# EAGLE design WallSwitch (EAGLE 6.5.0)
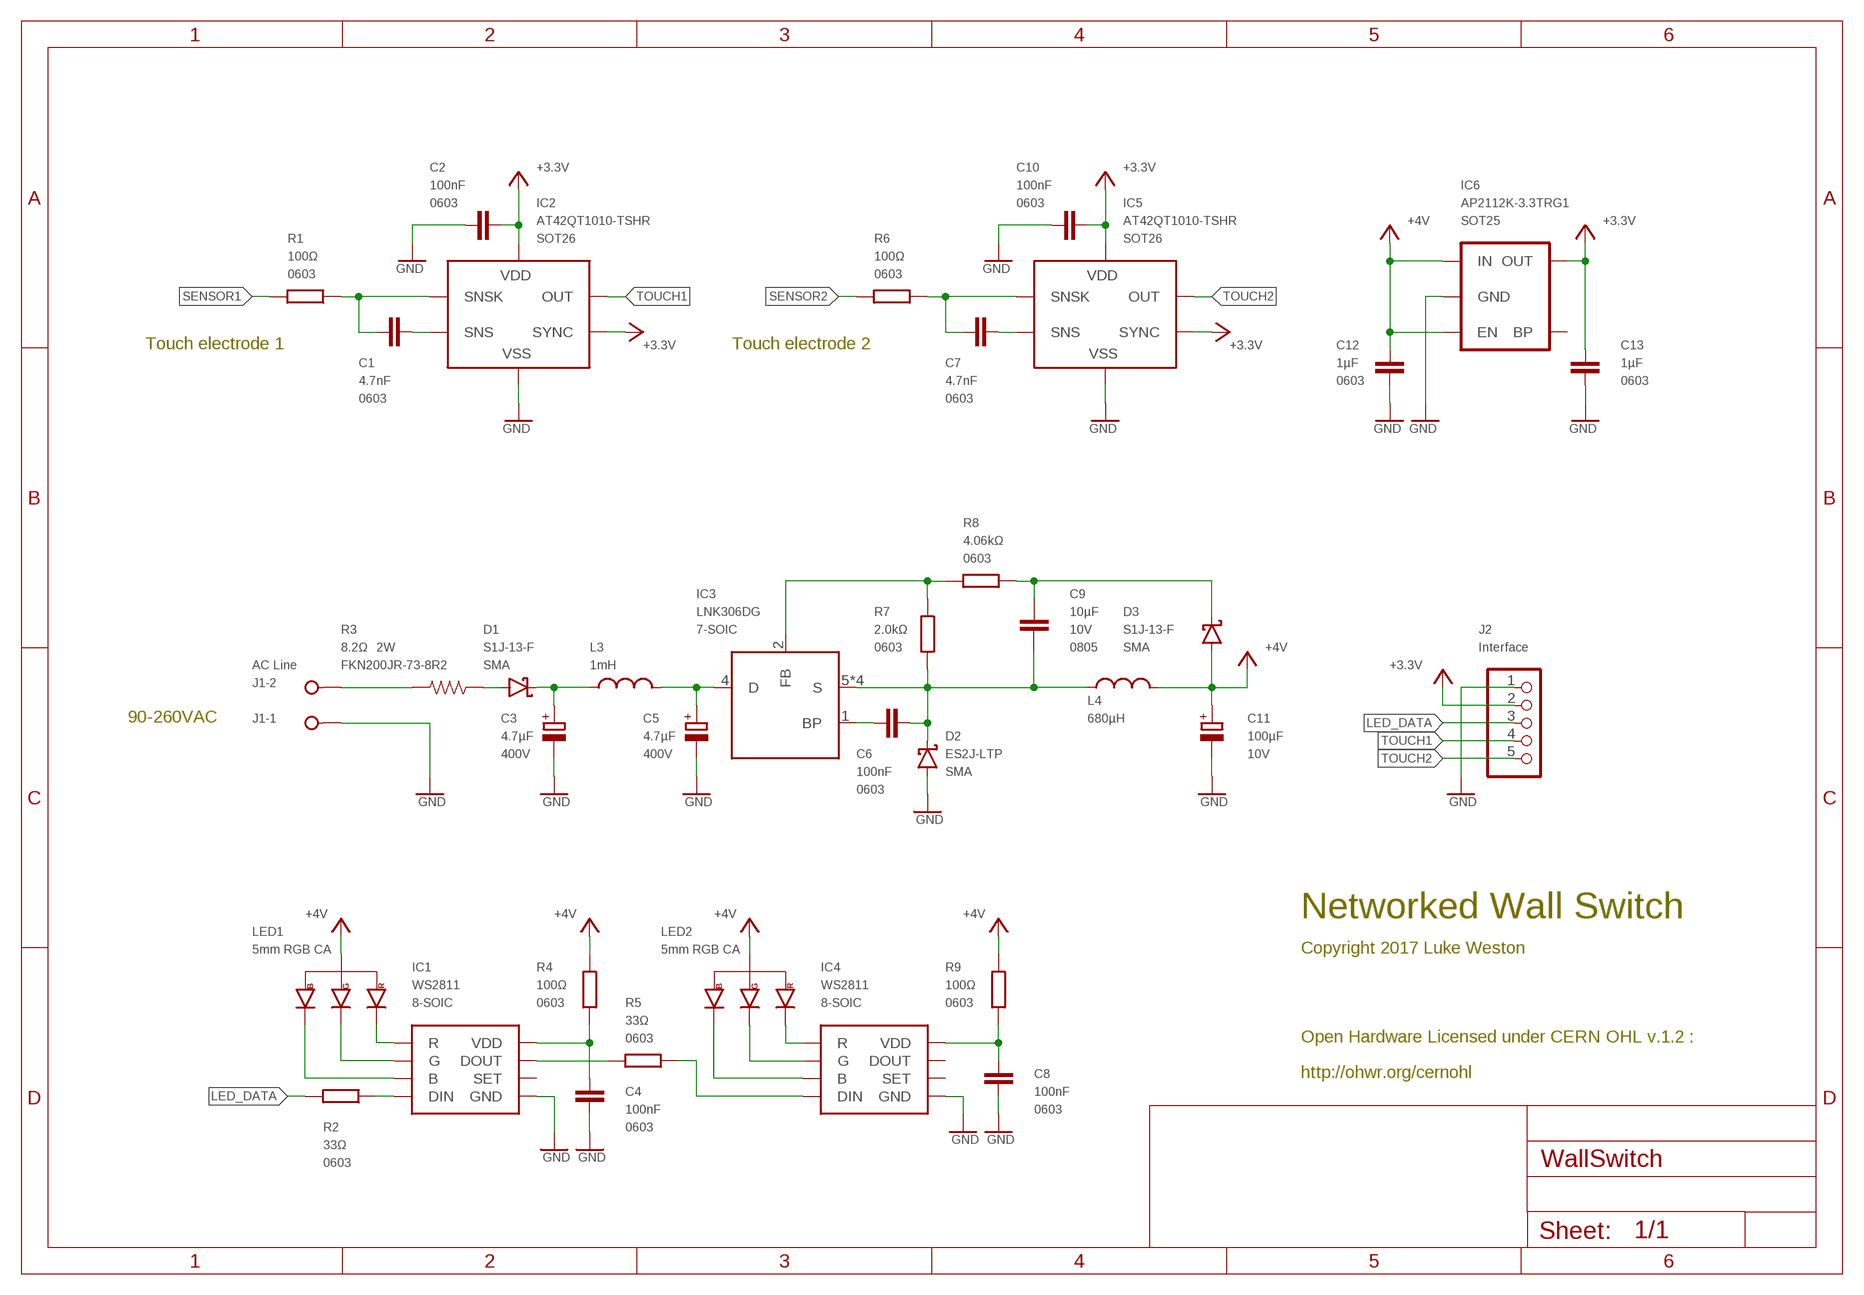
[diagram p0: schematic, sheet 1]

## Parts
C1  4.7nF  C0603  [0603]
C2  100nF  C0603  [0603]
C3  4.7µF  ELECTROLYTIC3.5MM  [ELECTRO-LARGE]
C4  100nF  C0603  [0603]
C5  4.7µF  ELECTROLYTIC3.5MM  [ELECTRO-LARGE]
C6  100nF  C0603  [0603]
C7  4.7nF  C0603  [0603]
C8  100nF  C0603  [0603]
C9  10µF  CAP0805  [0805]
C10  100nF  C0603  [0603]
C11  100µF  ELECTROLYTIC2MM  [ELECTRO-SMALL]
C12  1µF  C0603  [0603]
C13  1µF  C0603  [0603]
D1  S1J-13-F  SCHOTTKY-SMA  [SMA]
D2  ES2J-LTP  SCHOTTKY-SMA  [SMA]
D3  S1J-13-F  SCHOTTKY-SMA  [SMA]
IC1  WS2811  [SOIC-8]
IC2  AT42QT1010-TSHR  [SOT23-6]
IC3  LNK306DG  LNK304  [SO-8C]
IC4  WS2811  [SOIC-8]
IC5  AT42QT1010-TSHR  [SOT23-6]
IC6  AP2112K-3.3TRG1  V_REG_LDOSMD  [SOT23-5]
J1  AC Line  W237-02P  [W237-132]
J2  Interface  PINHD-1X5  [1X05]
L3  1mH  LRLB0608  [RLB0608]
L4  680µH  LRLB0914  [RLB0914]
LED1  5mm RGB CA  RGBLED_CA-5MM  [LED5MMRGB]
LED2  5mm RGB CA  RGBLED_CA-5MM  [LED5MMRGB]
R1  100Ω  R0603  [0603]
R2  33Ω  R0603  [0603]
R3  8.2Ω  RESISTORFKN200JR-73  [FKN200JR-73]
R4  100Ω  R0603  [0603]
R5  33Ω  R0603  [0603]
R6  100Ω  R0603  [0603]
R7  2.0kΩ  R0603  [0603]
R8  4.06kΩ  R0603  [0603]
R9  100Ω  R0603  [0603]

## Nets
+3.3V: C2.1 C10.1 C13.1 IC2.5(VDD) IC2.6(SYNC) IC5.5(VDD) IC5.6(SYNC) IC6.5(OUT) J2.2
+4V: C11.+ C12.1 D3.A IC6.1(IN) IC6.3(EN) L4.2 LED1.2(VCC) LED2.2(VCC) R4.1 R9.1
GND: C2.2 C3.- C4.2 C5.- C8.2 C10.2 C11.- C12.2 C13.2 D2.A IC1.4(GND) IC2.2(VSS) IC4.4(GND) IC5.2(VSS) IC6.2(GND) J1.1 J2.1
LED_DATA: J2.3 R2.2
N$1: IC1.1(R) LED1.1(RED)
N$2: J1.2 R3.2
N$3: C7.2 IC5.3(SNSK) R6.1
N$4: C7.1 IC5.4(SNS)
N$5: C1.2 IC2.3(SNSK) R1.1
N$6: C1.1 IC2.4(SNS)
N$7: D1.A R3.1
N$9: C3.+ D1.K L3.1
N$10: C5.+ IC3.4(D) L3.2
N$11: C6.2 IC3.1(BP)
N$12: C6.1 C9.1 D2.K IC3.5(S) IC3.6(S) IC3.7(S) IC3.8(S) L4.1 R7.2
N$13: IC1.2(G) LED1.3(GREEN)
N$14: IC1.3(B) LED1.4(BLUE)
N$15: IC3.2(FB) R7.1 R8.1
N$16: C9.2 D3.K R8.2
N$21: IC1.6(DIN) R2.1
N$22: C4.1 IC1.8(VDD) R4.2
N$23: IC1.5(DOUT) R5.2
N$24: IC4.6(DIN) R5.1
N$25: IC4.3(B) LED2.4(BLUE)
N$26: IC4.2(G) LED2.3(GREEN)
N$27: IC4.1(R) LED2.1(RED)
N$28: C8.1 IC4.8(VDD) R9.2
SENSOR1: R1.2
SENSOR2: R6.2
TOUCH1: IC2.1(OUT) J2.4
TOUCH2: IC5.1(OUT) J2.5
Unconnected: IC1.7(SET) IC4.5(DOUT) IC4.7(SET) IC6.4(BP)

## Notes on the sheet
- Touch electrode 1 | Touch electrode 2
- 90-260VAC
- Networked Wall Switch
- Copyright 2017 Luke Weston
- Open Hardware Licensed under CERN OHL v.1.2 :
- http://ohwr.org/cernohl

## Library data of the parts
C1 C2 C4 C6-C8 C10 C12 C13 = freetronics-luke:C; PACKAGE: 0603
C3 C5 = freetronics-luke:ELECTROLYTIC: Electrolytic capacitor; VOLTAGE: 400V
C9 = freetronics-master-v1:CAP: Capacitor Standard 0603 ceramic capacitor, and 0.1" leaded capacitor.; PACKAGE: 0805; VOLTAGE: 10V
C11 = freetronics-luke:ELECTROLYTIC: Electrolytic capacitor; VOLTAGE: 10V
D1-D3 = freetronics-luke:SCHOTTKY: Schottky diode; PACKAGE: SMA
IC1 IC4 = freetronics-luke:WS2811: WS2811 LED controller; PACKAGE: 8-SOIC
IC2 IC5 = freetronics-luke:AT42QT1010: Atmel AT42QT1010; PACKAGE: SOT26
IC3 = freetronics-luke:LNK304: LNK304 Off-Line Switchmode Controller; PACKAGE: 7-SOIC
IC6 = SparkFun:V_REG_LDO: Voltage Regulator LDO Standard 150mA LDO voltage regulator in SOT-23 layout. Micrel part MIC5205. BP (by-pass) pin is used to lower output noise with 470pF cap.; PACKAGE: SOT25
J1 = con-wago-508:W237-02P: WAGO SREW CLAMP; OC_FARNELL: unknown; OC_NEWARK: unknown
J2 = pinhead:PINHD-1X5: PIN HEADER
L3 L4 = freetronics-luke:L
LED1 LED2 = adafruit:RGBLED_CA: RGB LED, common-anode 5MM Staggered pins 5mm Piranha package http://www.ladyada.net/library/pcb/eaglelibrary.html
R1 R2 R4-R9 = freetronics-luke:R; PACKAGE: 0603
R3 = freetronics-luke:RESISTOR: Resistor; FOO: Fusible; ID: FKN200JR-73-8R2; POWER: 2W

## Net classes
0 default: width 0.152 mm, drill 0.241 mm, clearance 0.152 mm

## Board
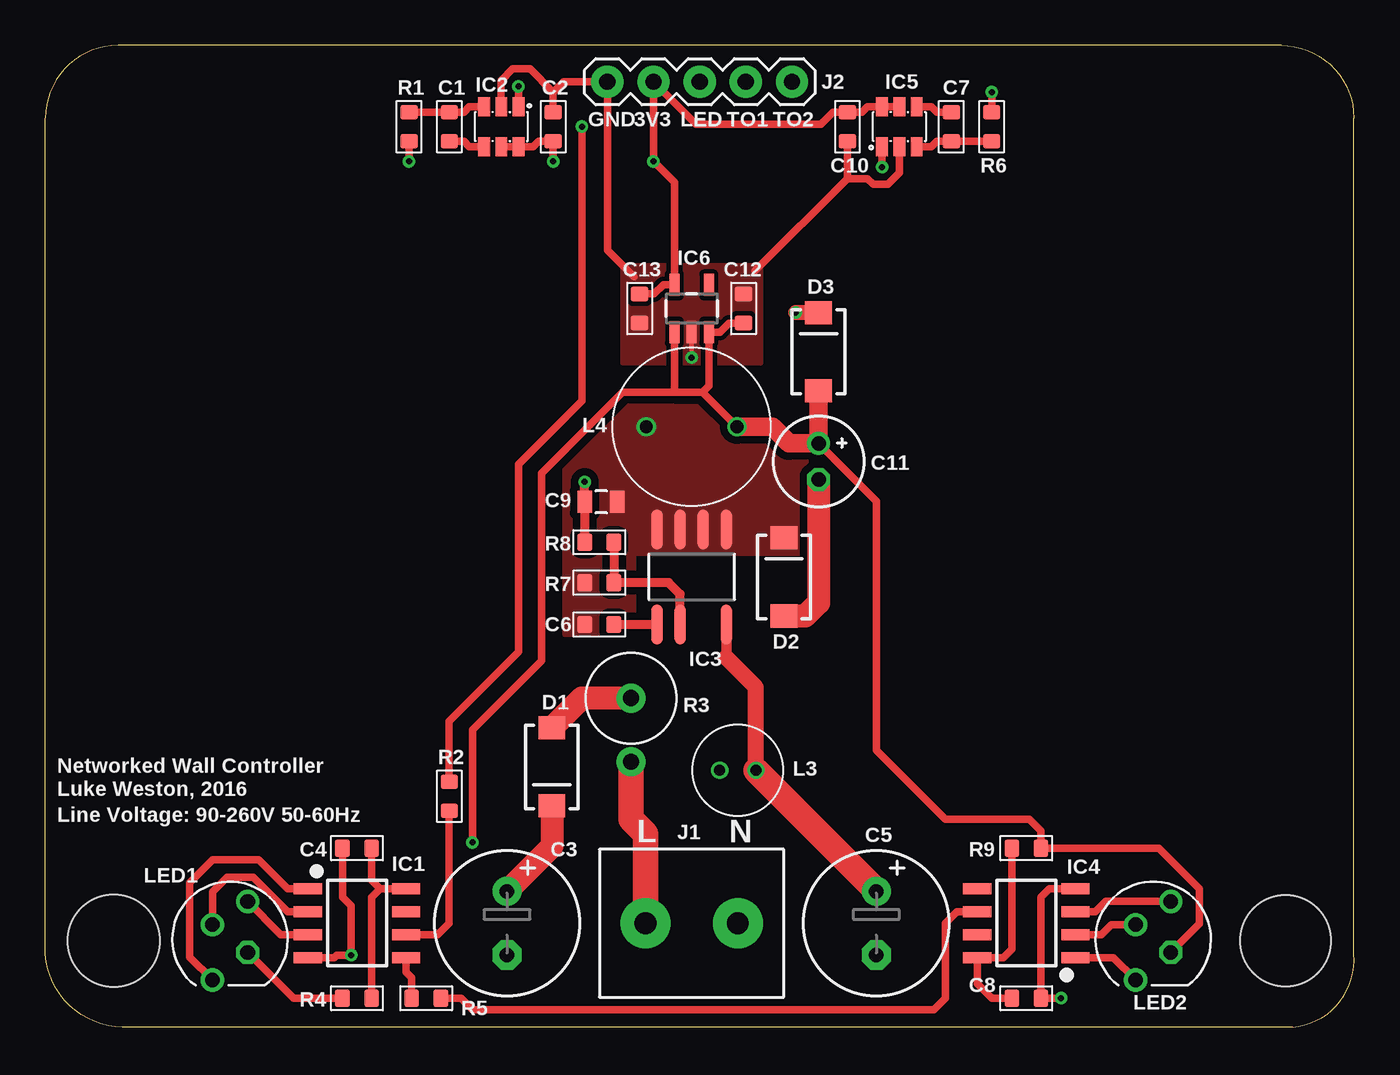
[diagram p1: board, top side]
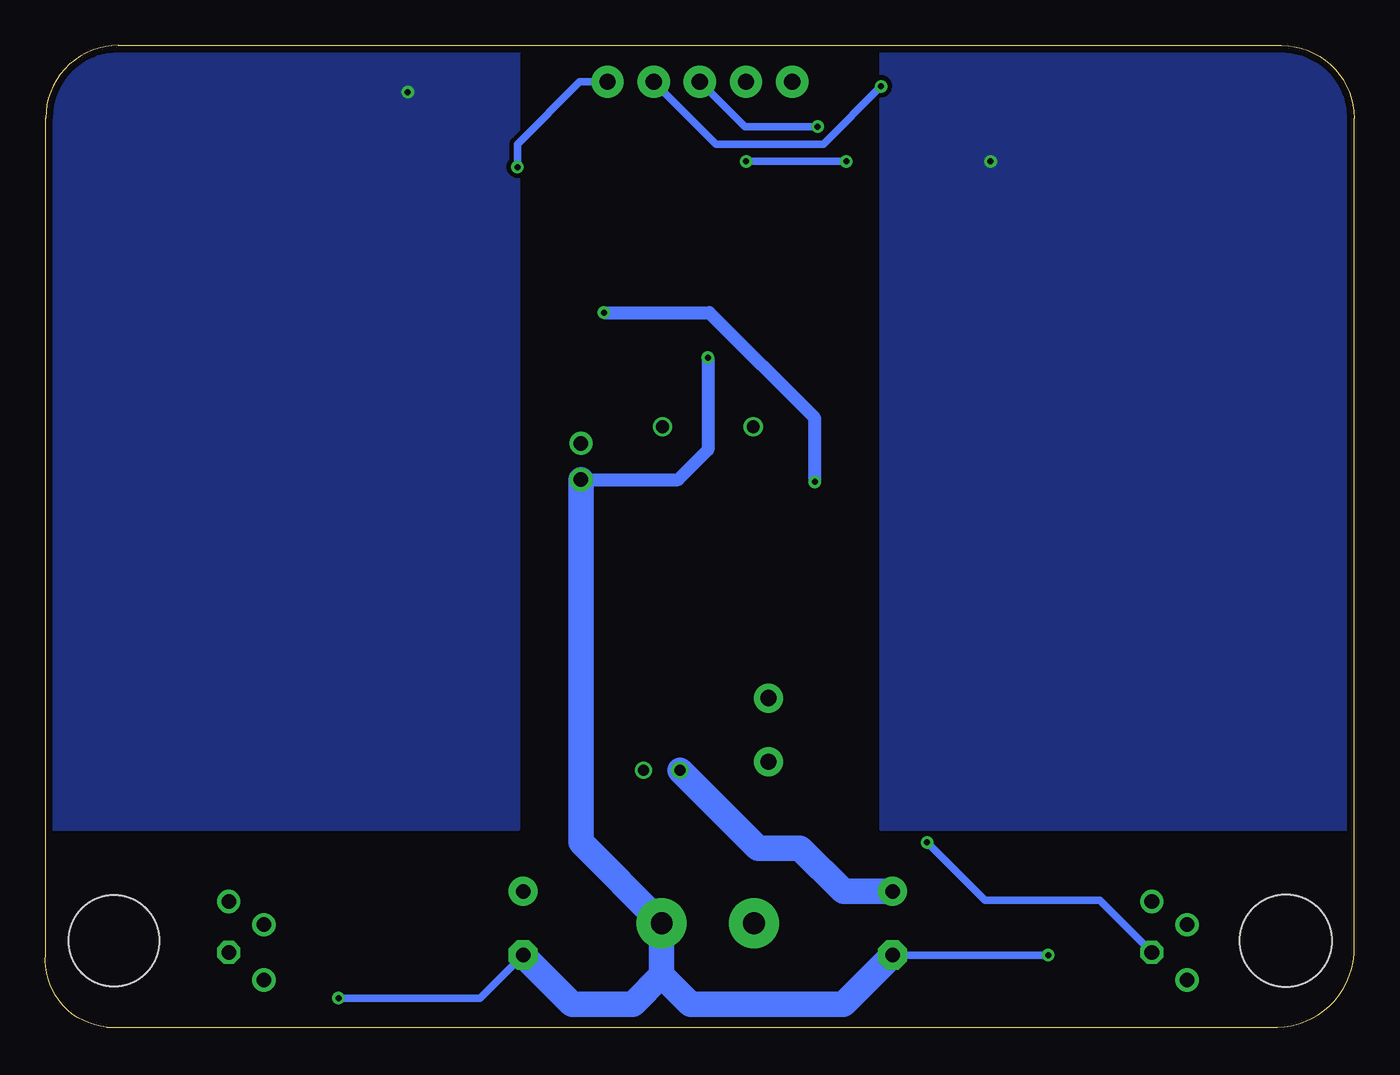
[diagram p2: board, bottom side, seen from below]

Size 72.01 x 54.01 mm. Coordinates in mm from the lower left corner, seen from the top.
Outline: 72,4.01 72,50.01 arc90 68,54.01 4,54.01 arc90 0,50.01 0,4.01 arc90 4.63,0.01 68.64,0.01 arc90 72,4.01
Copper layers (1*16): Top 0.0356mm / dielectric 1.5011mm / Bottom 0.0356mm
Design rules "LaenPCBOrder *": minimum track width 6mil, minimum drill 13mil, track to track 6mil, track to pad 6mil, pad to pad 6mil, via to via 6mil, smd to smd 6mil, copper to edge 15mil, drill to drill 6mil, minimum pad ring 7mil, minimum via ring 7mil, stop-mask expansion 3mil, vias tented up to drill 14mil, thermal gap 10mil
Holes 5.08 mm at 3.75,4.76
Holes 5 mm at 68.25,4.76

### Footprints (pad centres in the part's own frame; a part is rotated, then mirrored left to right if it is on the bottom)
0603 = smd 0.8 x 0.95: 1 -0.8,0; 2 0.8,0
ELECTRO-LARGE = drill 0.8 pad 1.6: + -1.75,0 | drill 0.8 pad 1.6 octagon: - 1.75,0
0805 = smd 0.8 x 1.2: 1 -0.9,0; 2 0.9,0
ELECTRO-SMALL = drill 0.8 pad 1.27: + -1,0 | drill 0.8 pad 1.27 octagon: - 1,0
SMA = smd 1.27 x 1.47: A -2.15,0; K 2.15,0
SOIC-8 = smd 0.6 x 1.55: 1 -1.905,-2.7; 2 -0.635,-2.7; 3 0.635,-2.7; 4 1.905,-2.7; 5 1.905,2.7; 6 0.635,2.7; 7 -0.635,2.7; 8 -1.905,2.7
SOT23-6 = smd 0.65 x 1.06: 1 -0.95,-1.1; 2 0,-1.1; 3 0.95,-1.1; 4 0.95,1.1; 5 0,1.1; 6 -0.95,1.1
SO-8C = smd 0.61 x 2.21: 1 -1.905,-2.616; 2 -0.635,-2.616; 4 1.905,-2.616; 5 1.905,2.616; 6 0.635,2.616; 7 -0.635,2.616; 8 -1.905,2.616
SOT23-5 = smd 0.55 x 1.2: 1 -0.95,-1.3; 2 0,-1.3; 3 0.95,-1.3; 4 0.95,1.3; 5 -0.95,1.3
W237-132 = drill 1.2 pad 2.75: 1 -2.54,0; 2 2.54,0
1X05 = drill 0.9 pad 1.778: 1 -5.08,0; 2 -2.54,0; 3 0,0; 4 2.54,0; 5 5.08,0
RLB0608 = drill 0.6: 1 -1,0; 2 1,0
RLB0914 = drill 0.7: 1 -2.5,0; 2 2.5,0
LED5MMRGB = drill 0.8 pad 1.27: 1 -2.159,0.968; 3 0.889,0.968; 4 2.159,-0.968 | drill 0.8 pad 1.27 octagon: 2 -0.635,-0.968
FKN200JR-73 = drill 0.9 pad 1.6: 1 0,0; 2 3.5,0

### Placement (x,y rotation side)
C1  22.23,49.54 90 top
C2  27.94,49.54 90 top
C3  25.4,5.73 270 top
C4  17.14,9.85 180 top
C5  45.72,5.73 270 top
C6  30.48,22.16 0 top
C7  49.85,49.54 270 top
C8  53.98,1.6 0 top
C9  30.58,28.9 180 top
C10  44.13,49.54 270 top
C11  42.55,31.13 270 top
C12  38.42,39.54 90 top
C13  32.7,39.54 270 top
D1  27.87,14.33 270 top
D2  40.64,24.78 90 top
D3  42.55,37.16 90 top
IC1  17.14,5.73 270 top
IC2  25.08,49.54 180 top
IC3  35.56,24.78 0 top
IC4  53.98,5.73 90 top
IC5  46.99,49.54 0 top
IC6  35.56,39.54 0 top
J1  35.56,5.73 180 top
J2  36,52.01 0 top
L3  38.1,14.14 0 top
L4  35.56,33.03 0 top
LED1  10.16,4.76 90 top
LED2  60.96,4.76 90 top
R1  20,49.54 270 top
R2  22.23,12.71 90 top
R3  32.23,18.11 270 top
R4  17.14,1.6 0 top
R5  20.95,1.6 180 top
R6  52.07,49.54 90 top
R7  30.48,24.46 180 top
R8  30.48,26.68 180 top
R9  53.98,9.85 180 top

### Tracks (layer width: path | path; a pad name or v marks a point on that pad's centre or on a via)
+3.3V  (via drill 0.33)
  Top 0.254: 34.61,40.68 IC6.5
  Top 0.406: C13.1 33.5,40.34 34,40.84 IC6.5 | IC2.5 IC2.6 26.84,48.44 27.14,48.74 C2.1 v27.94,47.64 | IC5.5 IC5.6 45.23,50.64 44.93,50.34 C10.1 43.34,50.34 42.67,49.66 35.81,49.66 J2.2 v33.46,47.64 34.61,46.49 34.61,40.68
  Bottom 0.406: v33.46,47.64 v27.94,47.64
+4V  (via drill 0.33)
  Top 0.406: LED2.2 63.5,5.7 63.5,7.63 61.28,9.85 R9.1 54.77,10.8 54.13,11.44 49.53,11.44 45.72,15.25 45.72,28.95 C11.+ | v23.5,10.17 23.5,16.36 27.3,20.17 27.3,30.49 31.75,34.94 34.61,34.94 | C12.1 37.62,38.74 37.12,38.24 IC6.3 36.51,35.29 36.16,34.94 | R4.1 13.66,1.6 LED1.2 | IC6.1 34.61,34.94 | 34.61,34.94 36.16,34.94 | 36.16,34.94 L4.2
  Top 1.016: D3.A C11.+ 40.91,32.13 40.01,33.03 L4.2
  Bottom 0.406: LED1.2 14,7 20.32,7 v23.5,10.17
GND  (via drill 0.33)
  Top 0.254: IC6.2 v35.56,36.84
  Top 0.406: IC4.4 55.24,7.63 54.77,7.16 C8.2 v55.88,1.6 | IC1.4 15.88,3.82 16.03,3.98 v16.83,3.98 16.83,6.68 16.34,7.16 C4.2 | IC2.2 25.08,52.08 25.72,52.72 26.67,52.72 27.94,51.45 | 27.94,51.45 C2.2 | IC5.2 46.99,47 46.35,46.37 45.56,46.37 45.24,46.68 44.13,46.68 | 32.38,41.29 30.92,42.75 J2.1 28.5,52.01 27.94,51.45 | 44.13,46.68 39.05,41.6 | 44.13,46.68 C10.2
  Top 1.27: C11.- 42.55,23.35 41.82,22.63 D2.A
  Bottom 0.406: v55.88,1.6 48.1,1.6 C5.- | v16.83,3.98 C3.-
  Bottom 0.711: v35.56,36.84 35.56,31.76 37.2,30.13 C11.-
  Bottom 1.397: C3.- 28.09,1.28 36.51,1.28 38.1,2.87 | 38.1,2.87 J1.1 42.55,10.17 C11.- | 38.1,2.87 39.69,1.28 43.02,1.28 C5.-
  pour Top (isolate 0.254, no thermals): 31.75,41.92 39.37,41.92 39.37,36.52 31.75,36.52
LED_DATA  (via drill 0.33)
  Top 0.406: R2.2 22.23,16.84 26.04,20.65 26.04,30.97 29.53,34.46 v29.53,49.54
  Bottom 0.406: v29.53,49.54 33.53,49.54 J2.3
N$1
  Top 0.406: LED1.1 7.94,3.86 7.94,7.95 9.21,9.22 11.75,9.22 13.34,7.63 IC1.1
N$2
  Top 1.397: J1.2 33.02,10.65 32.23,11.44 R3.2
N$3
  Top 0.406: IC5.3 48.75,48.44 49.05,48.74 C7.2 R6.1
N$4
  Top 0.406: IC5.4 48.75,50.64 49.05,50.34 C7.1
N$5
  Top 0.406: R1.1 C1.2 23.02,50.34 23.32,50.64 IC2.3
N$6
  Top 0.406: IC2.4 23.32,48.44 23.02,48.74 C1.1
N$7
  Top 1.27: R3.1 29.5,18.11 D1.A
N$9
  Top 1.27: D1.K 27.87,9.95 C3.+
  Bottom 1.397: L3.1 32.81,9.85 30.48,9.85 28.1,7.48 C3.+
N$10
  Top 0.584: 37.47,20.33 IC3.4
  Top 0.889: L3.2 39.1,18.7 37.47,20.33
  Top 1.397: C5.+ 45.72,7.52 L3.2
N$11
  Top 0.508: C6.2 IC3.1
N$12
  pour Top (isolate 0.406, no thermals): 28.57,34.3 43.81,34.3 43.81,26.05 32.38,26.05 32.38,21.6 28.57,21.6
N$13
  Top 0.406: IC1.2 13.34,6.36 11.43,8.27 10,8.27 9.19,7.46 LED1.3
N$14
  Top 0.406: IC1.3 12.96,5.09 LED1.4
N$15
  Top 0.508: IC3.2 34.92,23.82 34.29,24.46 R7.1 R8.1
N$16  (via drill 0.33)
  Top 0.508: R8.2 C9.2 v29.68,30.01
  Top 0.813: D3.K v41.27,39.31
  Bottom 0.711: v41.27,39.31 35.49,39.31 29.68,33.5 v29.68,30.01
N$21
  Top 0.406: R2.1 22.23,5.73 21.59,5.09 IC1.6
N$22
  Top 0.406: C4.1 17.95,8.1 18.41,7.63 | 18.41,7.63 IC1.8 | R4.2 17.95,7.16 18.41,7.63
N$23
  Top 0.406: IC1.5 19.84,3.03 20.16,2.72 R5.2
N$24
  Top 0.406: IC4.6 50.16,6.36 49.53,5.73 49.53,1.6 48.9,0.96 23.5,0.96 22.86,1.6 R5.1
N$25
  Top 0.406: IC4.3 57.78,6.36 58.34,6.92 LED2.4
N$26
  Top 0.406: LED2.3 58.66,5.65 58.1,5.09 IC4.2
N$27
  Top 0.406: IC4.1 58.77,3.82 LED2.1
N$28
  Top 0.406: C8.1 52.07,1.6 51.27,2.39 IC4.8 52.7,3.82 53.17,4.29 R9.2
SENSOR1  (via drill 0.33)
  Top 0.406: v20,47.64 R1.2
  pour Bottom (isolate 0.254): 0,54.01 26,54.01 26,10.93 0,10.93
SENSOR2  (via drill 0.33)
  Top 0.406: v52.07,51.45 R6.2
  pour Bottom (isolate 0.254): 72,54.01 46,54.01 46,10.93 72,10.93
TOUCH1  (via drill 0.33)
  Top 0.406: IC2.1 v26.03,51.76
  Bottom 0.406: J2.4 35.12,48.59 29.21,48.59 v26.03,51.76
TOUCH2  (via drill 0.33)
  Top 0.406: IC5.1 v46.04,47.32
  Bottom 0.406: J2.5 42.62,52.01 46.04,48.59 v46.04,47.32

### Text on the board
tPlace: GND | 3V3 | LED | TO1 | TO2 | Networked Wall Controller | Luke Weston, 2016 | Line Voltage: 90-260V 50-60Hz | L | N